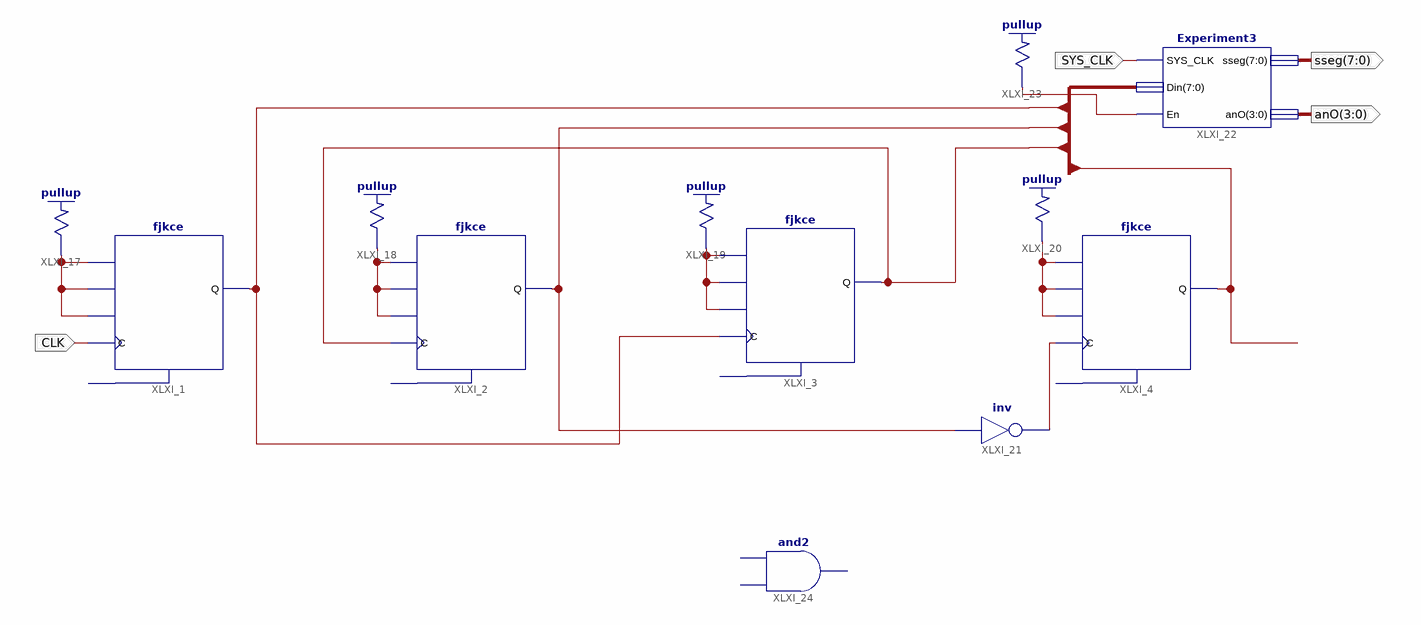
[diagram p0: schematic sheet 1]
// Xilinx ISE schematic Experiment9.sch (spartan3e) as structural Verilog: 12 symbols, 4 ports
module Experiment9 (
  input  CLK,
  input  SYS_CLK,
  output [7:0] sseg,
  output [3:0] anO
);

  wire XLXN_14, XLXN_18, XLXN_21, XLXN_28, XLXN_40, XLXN_47;
  wire [7:0] Din;

  fjkce XLXI_1 (.C(CLK), .CE(XLXN_28), .J(XLXN_28), .K(XLXN_28), .Q(Din[0]));  // open: CLR
  \pullup  XLXI_17 (.O(XLXN_28));
  fjkce XLXI_2 (.C(Din[2]), .CE(XLXN_14), .J(XLXN_14), .K(XLXN_14), .Q(Din[1]));  // open: CLR
  \pullup  XLXI_18 (.O(XLXN_14));
  fjkce XLXI_4 (.C(XLXN_47), .CE(XLXN_21), .J(XLXN_21), .K(XLXN_21), .Q(Din[3]));  // open: CLR
  \pullup  XLXI_20 (.O(XLXN_21));
  fjkce XLXI_3 (.C(Din[0]), .CE(XLXN_18), .J(XLXN_18), .K(XLXN_18), .Q(Din[2]));  // open: CLR
  \pullup  XLXI_19 (.O(XLXN_18));
  Experiment3 XLXI_22 (.SYS_CLK(SYS_CLK), .Din(Din), .En(XLXN_40), .sseg(sseg), .anO(anO));
  \pullup  XLXI_23 (.O(XLXN_40));
  not XLXI_21 (XLXN_47, Din[1]);
  // and2 XLXI_24 is placed but not wired
endmodule
